# EAGLE design jtag-isp dapter (EAGLE 6.1)
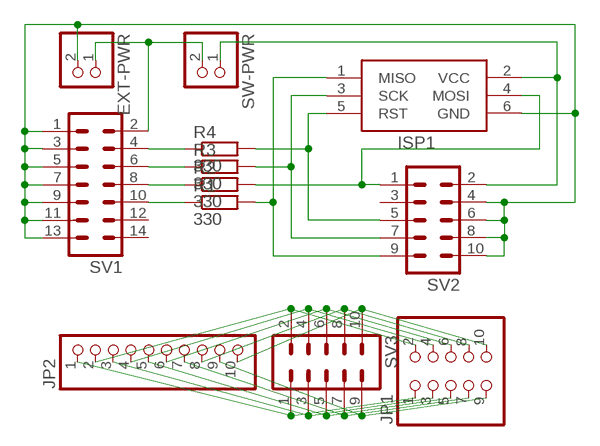
[diagram p0: schematic, sheet 1]

## Parts
EXT-PWR  PINHD-1X2  [1X02]
ISP1  AVRISP-6  [AVRISP]
JP1  PINHD-2X5  [2X05]
JP2  PINHD-1X10  [1X10]
R1  330  R-EU_0204/7  [0204/7]
R2  330  R-EU_0204/7  [0204/7]
R3  330  R-EU_0204/7  [0204/7]
R4  330  R-EU_0204/7  [0204/7]
SV1  ML14  [ML14]
SV2  ML10  [ML10]
SV3  ML10  [ML10]
SW-PWR  PINHD-1X2  [1X02]

## Nets
N$1: JP1.1 JP2.1 SV3.1
N$2: JP1.3 JP2.3 SV3.3
N$3: JP1.5 JP2.5 SV3.5
N$4: JP1.7 JP2.7 SV3.7
N$5: JP1.9 JP2.9 SV3.9
N$6: JP1.2 JP2.2 SV3.2
N$7: JP1.4 JP2.4 SV3.4
N$8: JP1.6 JP2.6 SV3.6
N$9: JP1.8 JP2.8 SV3.8
N$10: JP1.10 JP2.10 SV3.10
N$11: EXT-PWR.2 ISP1.6(GND) SV1.1 SV1.3 SV1.5 SV1.7 SV1.9 SV1.11 SV1.13 SV2.4 SV2.6 SV2.8 SV2.10
N$13: ISP1.4(MOSI) R2.2 SV2.1
N$14: ISP1.5(RST) R4.2 SV2.5
N$15: ISP1.3(SCK) R3.2 SV2.7
N$16: ISP1.1(MISO) R1.2 SV2.9
N$17: R1.1 SV1.10
N$18: R2.1 SV1.8
N$19: R3.1 SV1.6
N$20: R4.1 SV1.4
N$21: EXT-PWR.1 SV1.2 SW-PWR.2
VCC: ISP1.2(VCC) SV2.2 SW-PWR.1
Unconnected: SV1.12 SV1.14 SV2.3

## Library data of the parts
EXT-PWR SW-PWR = pinhead:PINHD-1X2: PIN HEADER
ISP1 = adafruit:AVRISP: AVR ISP HEADER Standard 6 pin header for AVR programming
JP1 = pinhead:PINHD-2X5: PIN HEADER
JP2 = pinhead:PINHD-1X10: PIN HEADER
R1-R4 = rcl:R-EU_: RESISTOR, European symbol
SV1 = con-harting-ml:ML14: HARTING; OC_FARNELL: unknown; OC_NEWARK: unknown
SV2 SV3 = con-harting-ml:ML10: HARTING; OC_FARNELL: unknown; OC_NEWARK: unknown

## Board
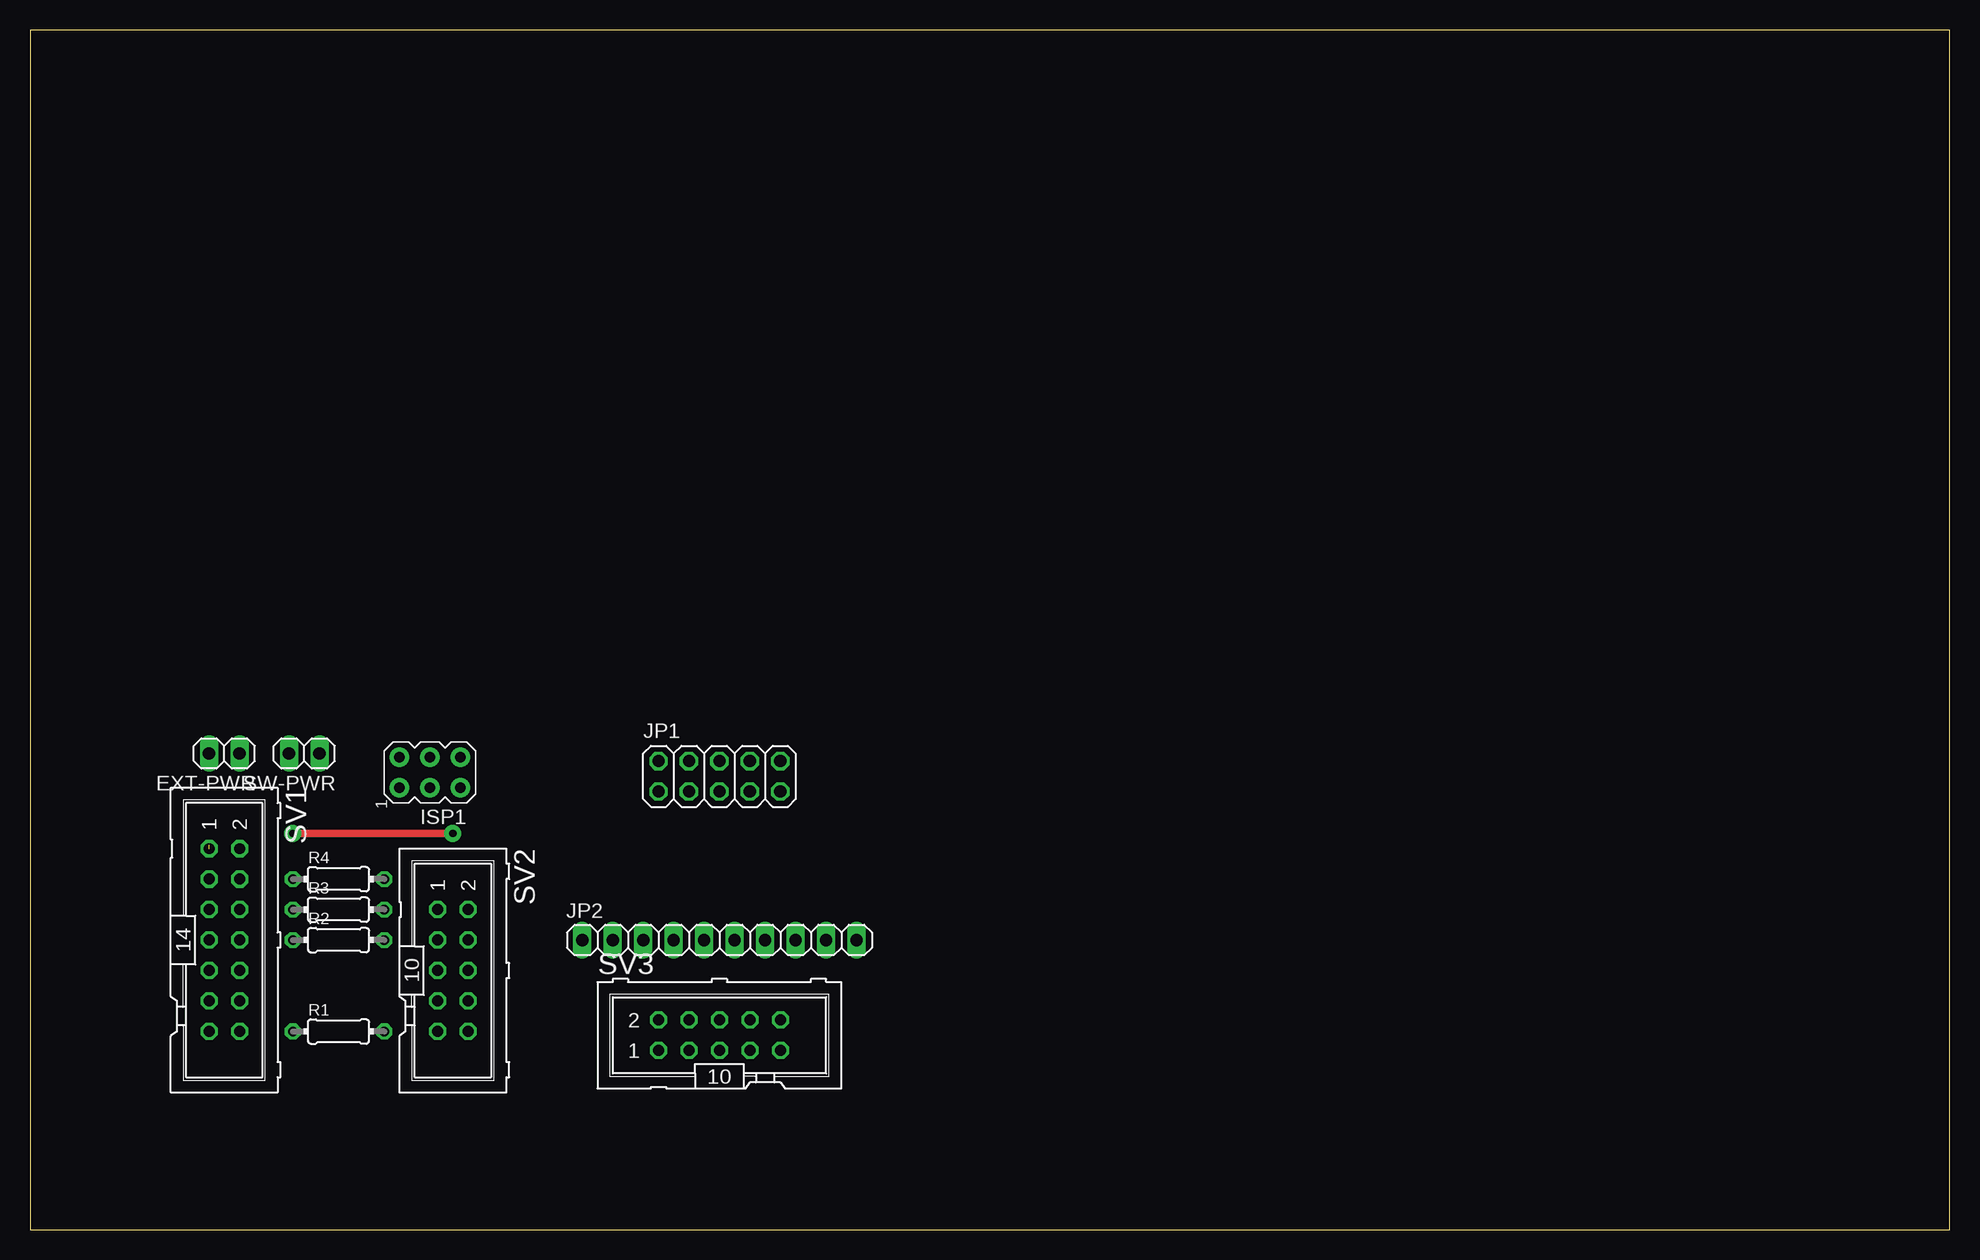
[diagram p1: board, top side]
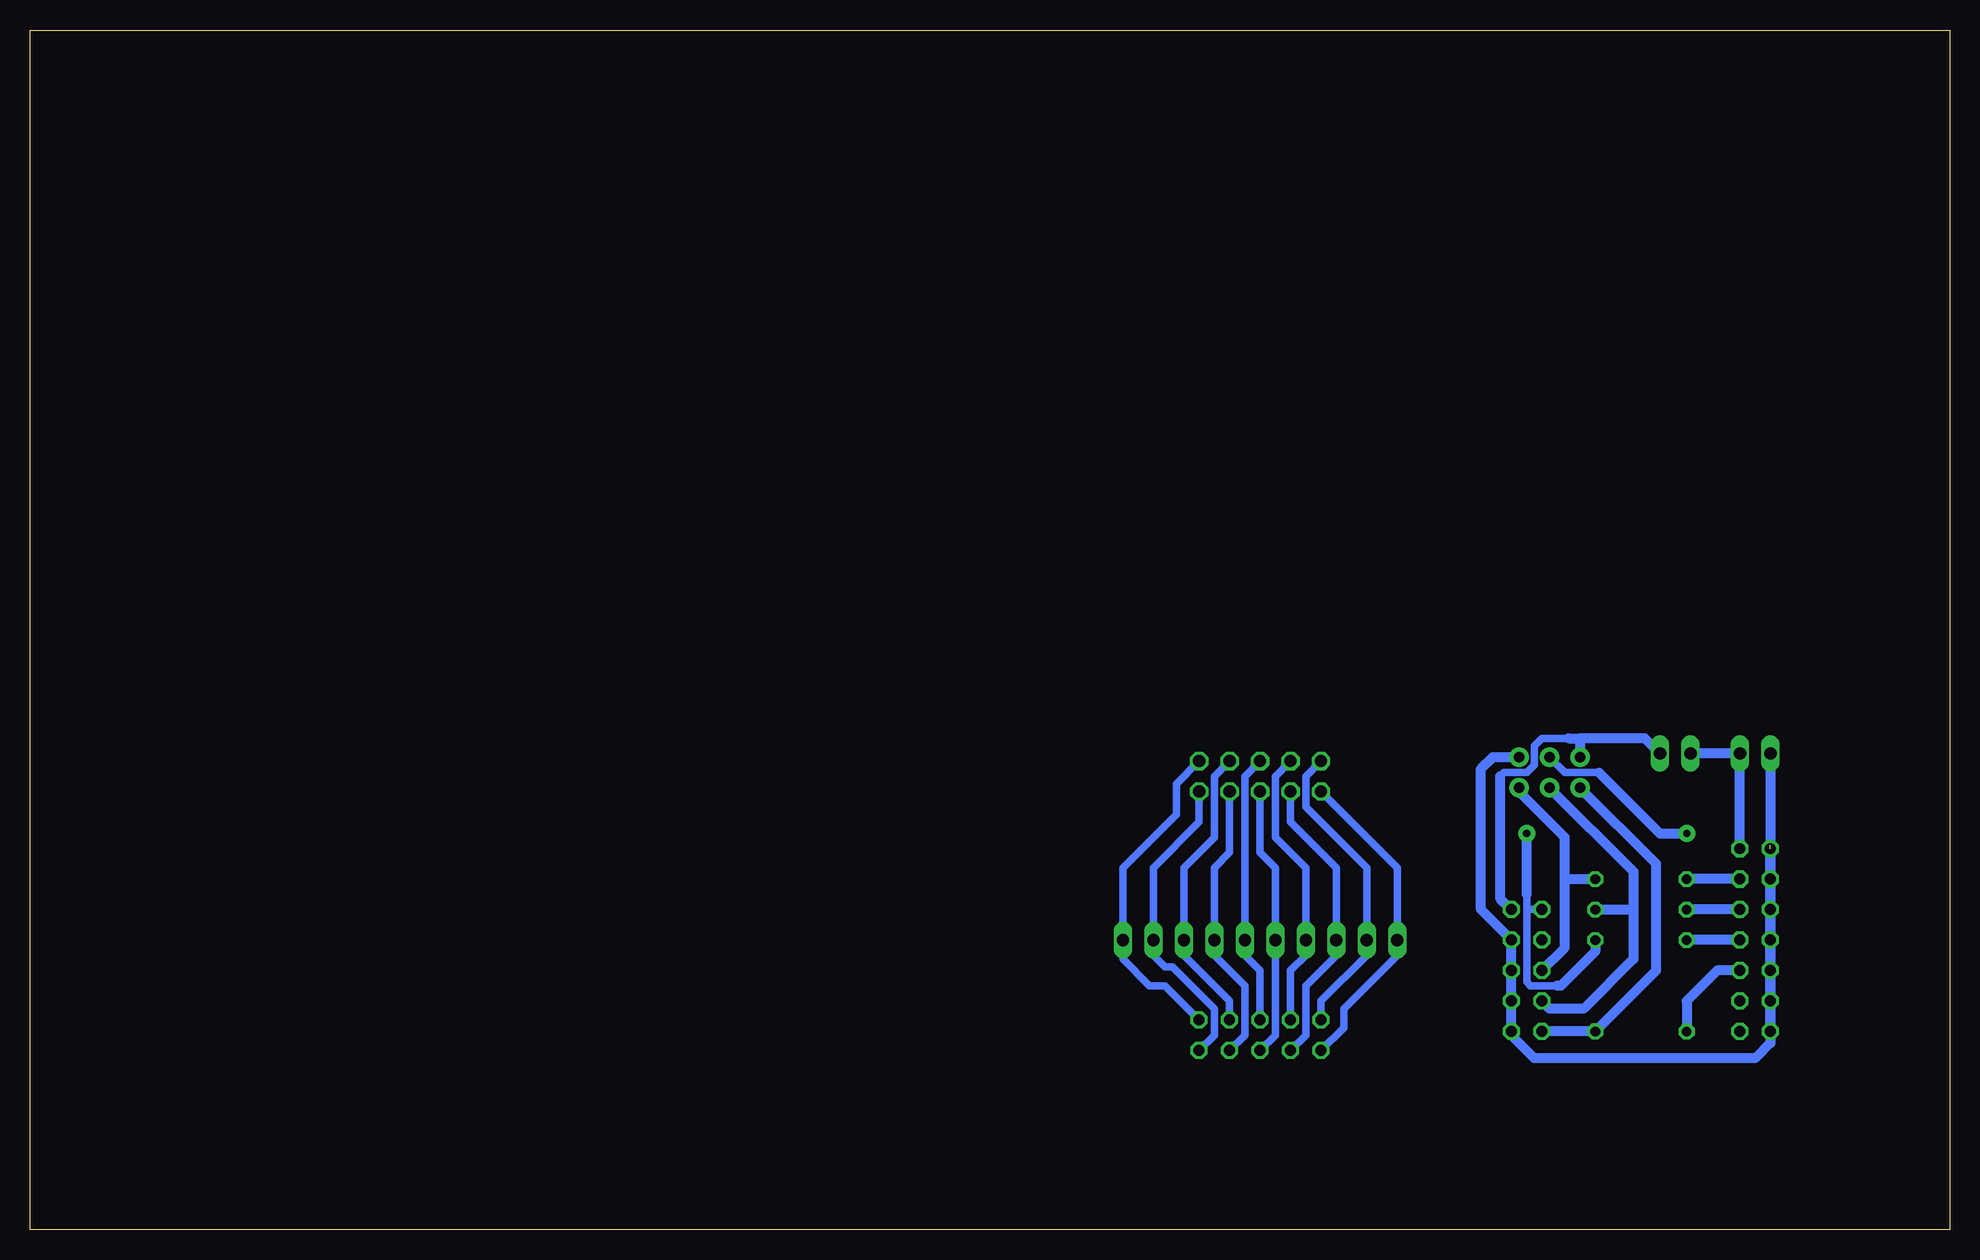
[diagram p2: board, bottom side, seen from below]

Size 160 x 100 mm. Coordinates in mm from the lower left corner, seen from the top.
Outline: 0,0 160,0 160,100 0,100 0,0
Copper layers (1*16): Top 0.035mm / dielectric 1.5mm / Bottom 0.035mm
Design rules: minimum track width 10mil, minimum drill 24mil, track to track 8mil, track to pad 8mil, pad to pad 8mil, via to via 8mil, smd to smd 8mil, copper to edge 40mil, drill to drill 8mil, minimum pad ring 10mil, minimum via ring 8mil, stop-mask expansion 4mil, vias tented up to drill 0mil, thermal gap 10mil

### Footprints (pad centres in the part's own frame; a part is rotated, then mirrored left to right if it is on the bottom)
1X02 = drill 1.016 long: 1 -1.27,0; 2 1.27,0
AVRISP = drill 0.9 pad 1.626: 1 -1.27,2.54; 2 1.27,2.54; 3 -1.27,0; 4 1.27,0; 5 -1.27,-2.54; 6 1.27,-2.54
2X05 = drill 1.016 octagon: 1 -5.08,-1.27; 2 -5.08,1.27; 3 -2.54,-1.27; 4 -2.54,1.27; 5 0,-1.27; 6 0,1.27; 7 2.54,-1.27; 8 2.54,1.27; 9 5.08,-1.27; 10 5.08,1.27
1X10 = drill 1.016 long: 1 -11.43,0; 2 -8.89,0; 3 -6.35,0; 4 -3.81,0; 5 -1.27,0; 6 1.27,0; 7 3.81,0; 8 6.35,0; 9 8.89,0; 10 11.43,0
0204/7 = drill 0.813 octagon: 1 -3.81,0; 2 3.81,0
ML14 = drill 0.914 octagon: 1 -7.62,-1.27; 2 -7.62,1.27; 3 -5.08,-1.27; 4 -5.08,1.27; 5 -2.54,-1.27; 6 -2.54,1.27; 7 0,-1.27; 8 0,1.27; 9 2.54,-1.27; 10 2.54,1.27; 11 5.08,-1.27; 12 5.08,1.27; 13 7.62,-1.27; 14 7.62,1.27
ML10 = drill 0.914 octagon: 1 -5.08,-1.27; 2 -5.08,1.27; 3 -2.54,-1.27; 4 -2.54,1.27; 5 0,-1.27; 6 0,1.27; 7 2.54,-1.27; 8 2.54,1.27; 9 5.08,-1.27; 10 5.08,1.27

### Placement (x,y rotation side)
EXT-PWR  16.19,39.69 180 top
ISP1  33.34,38.1 90 top
JP1  57.47,37.78 0 top
JP2  57.47,24.13 0 top
R1  25.72,16.51 0 top
R2  25.72,24.13 0 top
R3  25.72,26.67 0 top
R4  25.72,29.21 0 top
SV1  16.19,24.13 270 top
SV2  35.24,21.59 270 top
SV3  57.47,16.19 0 top
SW-PWR  22.86,39.69 180 top

### Tracks (layer width: path | path; a pad name or v marks a point on that pad's centre or on a via)
N$1
  Bottom 0.61: SV3.1 50.48,16.83 50.48,18.41 46.04,22.86 JP2.1 46.04,30.16 JP1.1
N$2
  Bottom 0.61: SV3.3 53.66,16.19 53.66,20.32 51.12,22.86 JP2.3 51.12,30.16 54.93,33.97 JP1.3
N$3
  Bottom 0.61: SV3.5 56.2,16.19 JP2.5 56.2,30.16 57.47,31.43 JP1.5
N$4
  Bottom 0.61: SV3.7 58.74,16.19 58.74,20.32 61.28,22.86 JP2.7 61.28,30.16 60.01,31.43 JP1.7
N$5
  Bottom 0.61: SV3.9 61.28,16.19 61.28,18.41 64.77,21.91 65.41,21.91 66.36,22.86 JP2.9 66.36,30.16 62.55,33.97 JP1.9
N$6
  Bottom 0.61: JP1.2 53.66,37.78 53.66,35.24 48.58,30.16 JP2.2 48.58,22.86 52.39,19.05 SV3.2
N$7
  Bottom 0.61: JP1.4 56.2,37.78 56.2,32.7 53.66,30.16 JP2.4 53.66,22.86 54.93,21.59 SV3.4
N$8
  Bottom 0.61: JP1.6 58.74,37.78 JP2.6 58.74,22.86 57.47,21.59 SV3.6
N$9
  Bottom 0.61: JP1.8 61.28,37.78 61.28,32.7 63.82,30.16 JP2.8 63.82,22.86 60.01,19.05 SV3.8
N$10
  Bottom 0.61: SV3.10 65.41,20.32 66.67,20.32 68.9,22.54 JP2.10 68.9,30.16 64.45,34.61 64.45,37.15 JP1.10
N$11  (1 unrouted)
  Bottom 0.813: SV1.13 SV1.11 SV1.9 SV1.7 SV1.5 SV1.3 SV1.1 SV1.13 | SV1.13 14.92,15.56 16.19,14.29 34.61,14.29 36.51,16.19 SV2.10 SV2.8 SV2.6 SV2.4 39.05,26.67 39.05,38.42 38.1,39.37 ISP1.6 | EXT-PWR.2 14.92,32.07
N$13  (via drill 0.6 pad 1.42)
  Top 0.61: v21.91,33.02 v35.24,33.02
  Bottom 0.61: 32.7,20.32 34.92,20.32 35.24,20.64 35.24,26.67 | 35.24,26.67 35.24,27.94 | SV2.1 35.24,26.67 | ISP1.4 32.07,38.1 29.21,38.1
  Bottom 0.813: 35.24,27.94 v35.24,33.02 | R2.2 29.53,23.18 32.38,20.32 32.7,20.32 | 29.21,38.1 24.13,33.02 v21.91,33.02
N$14
  Bottom 0.813: SV2.5 32.07,23.5 32.07,29.21 | 32.07,29.21 R4.2 | 32.07,29.21 32.07,32.7 35.88,36.51 ISP1.5
N$15
  Bottom 0.813: R3.2 26.35,26.67 | ISP1.3 26.35,29.84 26.35,26.67 | 26.35,26.67 26.35,22.54 30.48,18.41 33.34,18.41 SV2.7
N$16
  Bottom 0.813: ISP1.1 24.45,30.48 24.45,21.59 R1.2 SV2.9
N$17
  Bottom 0.813: SV1.10 19.37,21.59 21.91,19.05 R1.1
N$18
  Bottom 0.813: SV1.8 R2.1
N$19
  Bottom 0.813: SV1.6 R3.1
N$20
  Bottom 0.813: SV1.4 R4.1
N$21
  Bottom 0.813: SV1.2 EXT-PWR.1 SW-PWR.2
VCC
  Bottom 0.61: 37.47,37.78 37.15,38.1 35.24,38.1 34.61,38.73 34.61,40.32 33.97,40.96 31.75,40.96
  Bottom 0.813: SV2.2 37.47,27.62 37.47,37.78 | SW-PWR.1 25.4,40.96 30.8,40.96 | 30.8,40.96 ISP1.2 | 31.75,40.96 30.8,40.96